# Altium schematic sheet 6_DIG.SchDoc: AX309  Http://www.heijin.org
size 449 x 250 mm; DocumentNumber: 6; SheetNumber: 7; SheetTotal: 8; PageSetup: Record=PageOptions|CenterHorizontal=True|CenterVertical=True|PrintScale=0.75|XCorrection=1.00|YCorrection=1.00|PrintKind=0|BorderSize=5000000|LeftOffset=0|BottomOffset=0|Orientation=2|PaperLength=1000|PaperWidth=1000|Scale=100|PaperSource=7|PrintQuality=-4|MediaType=1|DitherType=10|PrintScaleMode=1|PaperKind=A4|PaperIndex=9
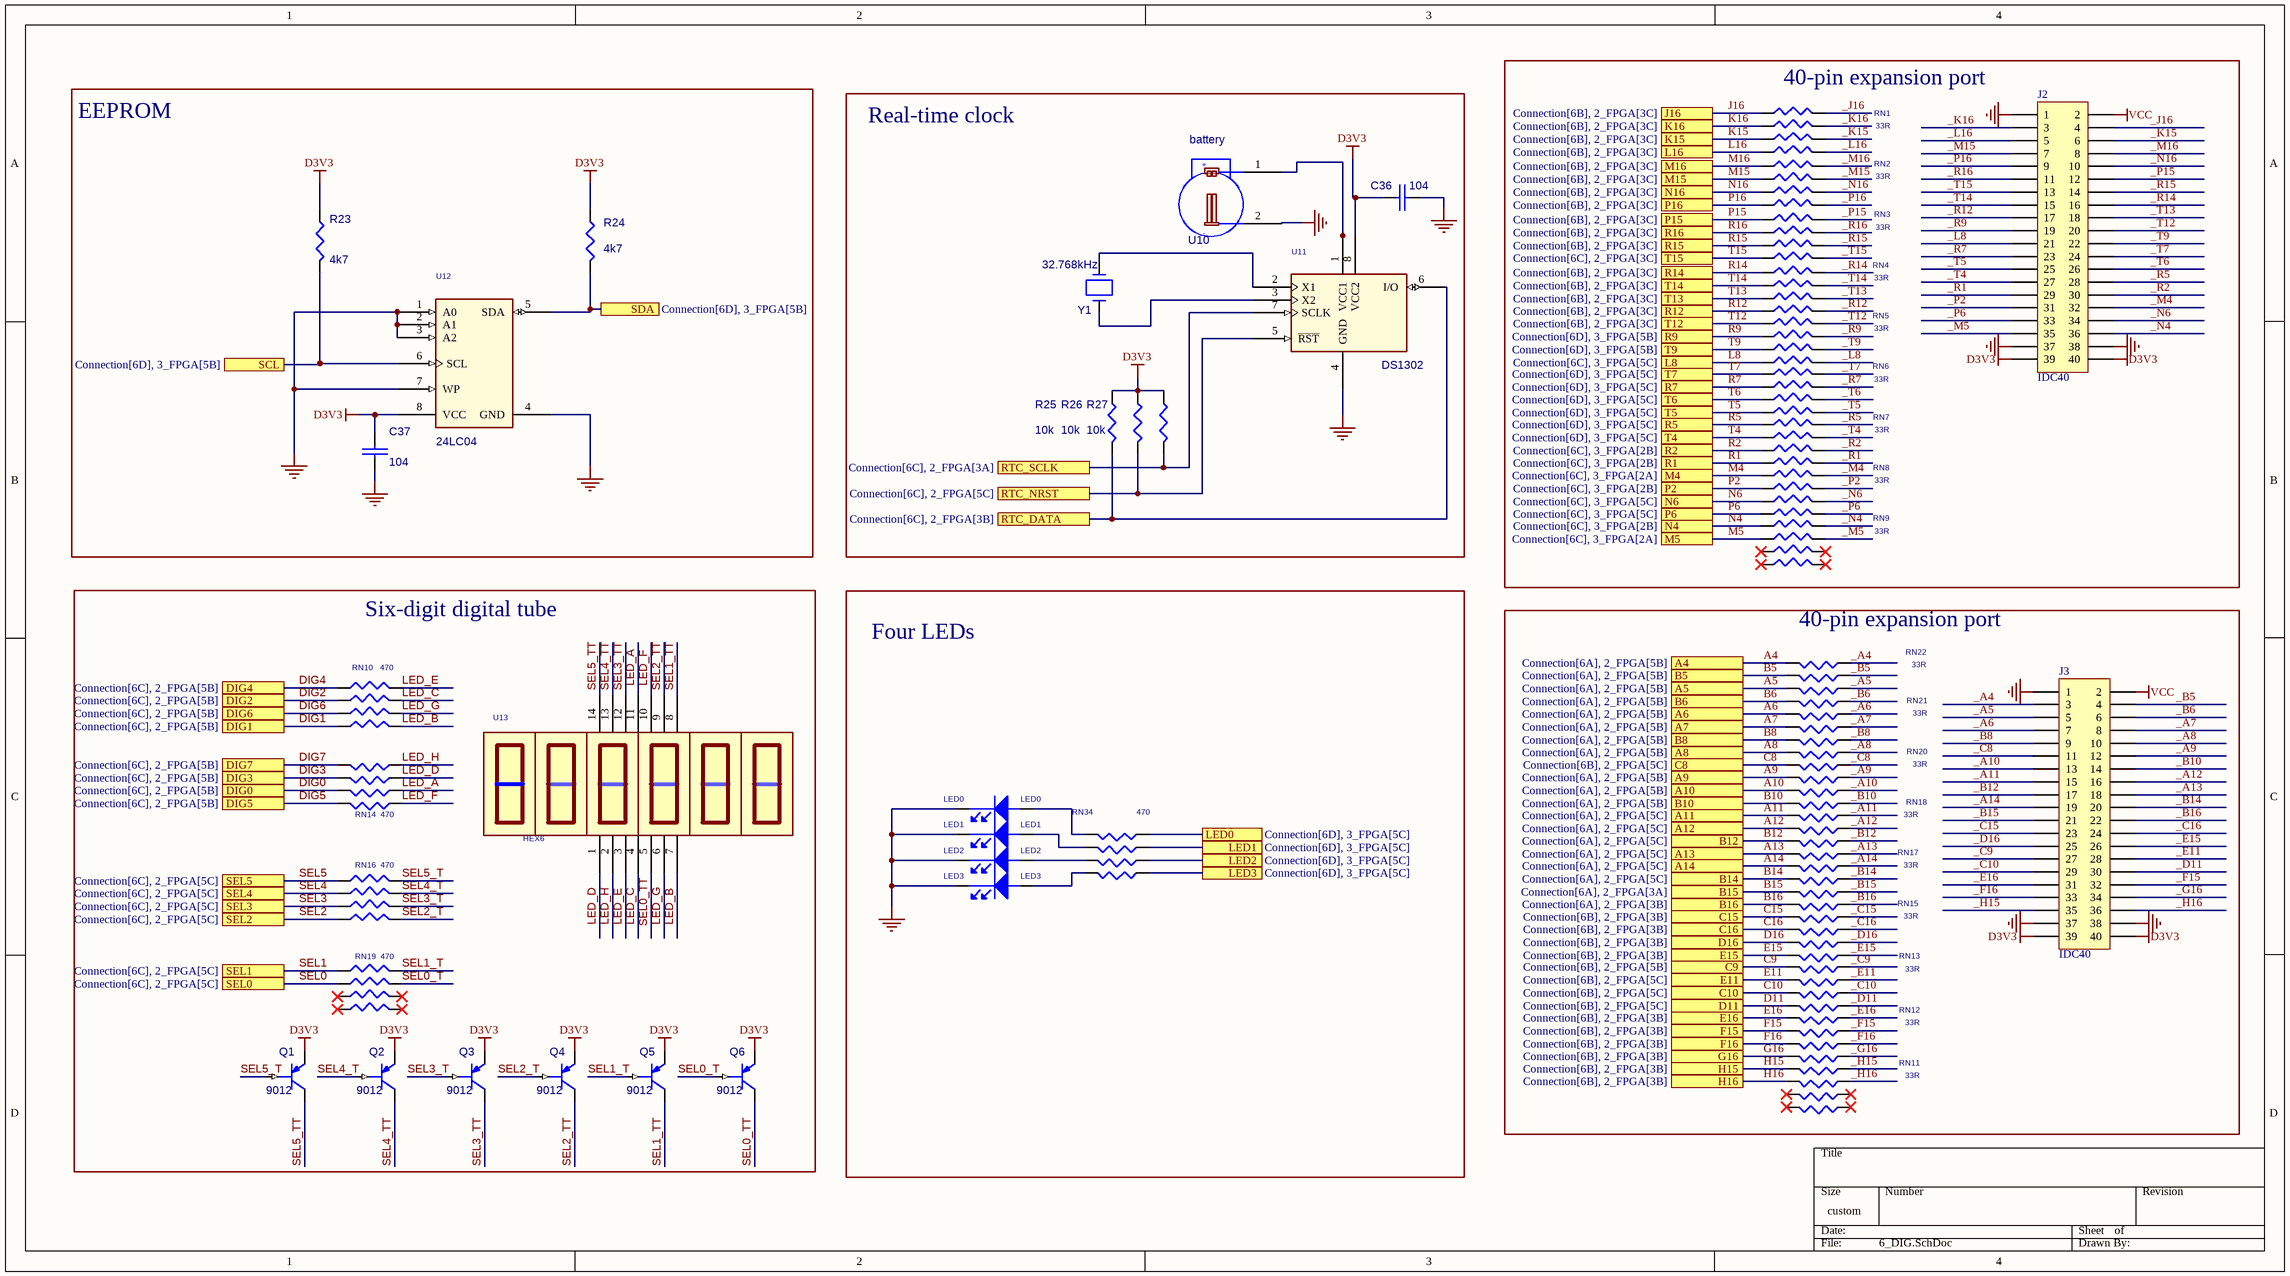
[diagram p0: 6_DIG.SchDoc]

## Parts
C36  104  [0402]
C37  104  [0402]
J2  IDC40  [IDC-40J]
J3  IDC40  [IDC-40J]
LED0  LED0  [LEDSO]
LED1  LED1  [LEDso]
LED2  LED2  [LEDSO]
LED3  LED3  [LEDSO]
Q1  9012  [SOT23]
Q2  9012  [SOT23]
Q3  9012  [SOT23]
Q4  9012  [SOT23]
Q5  9012  [SOT23]
Q6  9012  [SOT23]
R23  4k7  [0603]
R24  4k7  [0603]
R25  10k  [0603]
R26  10k  [0603]
R27  10k  [0603]
RN1  33R  [RN-8P]
RN2  33R  [RN-8P]
RN3  33R  [RN-8P]
RN4  33R  [RN-8P]
RN5  33R  [RN-8P]
RN6  33R  [RN-8P]
RN7  33R  [RN-8P]
RN8  33R  [RN-8P]
RN9  33R  [RN-8P]
RN10  470  [RN-8P]
RN11  33R  [RN-8P]
RN12  33R  [RN-8P]
RN13  33R  [RN-8P]
RN14  470  [RN-8P]
RN15  33R  [RN-8P]
RN16  470  [RN-8P]
RN17  33R  [RN-8P]
RN18  33R  [RN-8P]
RN19  470  [RN-8P]
RN20  33R  [RN-8P]
RN21  33R  [RN-8P]
RN22  33R  [RN-8P]
RN34  470  [RN-8P]
U10  battery  [BATSO]
U11  DS1302  [SO8]
U12  24LC04  [SO8]
U13  HEX6  [NIX_6]
Y1  32.768kHz  [CY_SMALL]

## Blocks framed on the sheet
40-pin expansion port: J2 RN1-RN9
EEPROM: C37 R23 R24 U12
Real-time clock: C36 R25-R27 U10 U11 Y1
Six-digit digital tube: Q1-Q6 RN10 RN14 RN16 RN19 U13
Four LEDs: LED0-LED3 RN34
40-pin expansion port: J3 RN11-RN13 RN15 RN17 RN18 RN20-RN22

## Ports
A4 (see Connection[6A], 2_FPGA[5B]), A5 (see Connection[6A], 2_FPGA[5B]), A6 (see Connection[6A], 2_FPGA[5B]), A7 (see Connection[6A], 2_FPGA[5B]), A8 (see Connection[6A], 2_FPGA[5B]), A9 (see Connection[6A], 2_FPGA[5B]), A10 (see Connection[6A], 2_FPGA[5B]), A11 (see Connection[6A], 2_FPGA[5C]), A12 (see Connection[6A], 2_FPGA[5C]), A13 (see Connection[6A], 2_FPGA[5C]), A14 (see Connection[6A], 2_FPGA[5C]), B5 (see Connection[6A], 2_FPGA[5B]), B6 (see Connection[6A], 2_FPGA[5B]), B8 (see Connection[6A], 2_FPGA[5B]), B10 (see Connection[6A], 2_FPGA[5B]), B12 (see Connection[6A], 2_FPGA[5C]), B14 (see Connection[6A], 2_FPGA[5C]), B15 (see Connection[6A], 2_FPGA[3A]), B16 (see Connection[6A], 2_FPGA[3B]), C8 (see Connection[6B], 2_FPGA[5C]), C9 (see Connection[6B], 2_FPGA[5B]), C10 (see Connection[6B], 2_FPGA[5C]), C15 (see Connection[6B], 2_FPGA[3B]), C16 (see Connection[6B], 2_FPGA[3B]), D11 (see Connection[6B], 2_FPGA[5C]), D16 (see Connection[6B], 2_FPGA[3B]), DIG0 (see Connection[6C], 2_FPGA[5B]), DIG1 (see Connection[6C], 2_FPGA[5B]), DIG2 (see Connection[6C], 2_FPGA[5B]), DIG3 (see Connection[6C], 2_FPGA[5B]), DIG4 (see Connection[6C], 2_FPGA[5B]), DIG5 (see Connection[6C], 2_FPGA[5B]), DIG6 (see Connection[6C], 2_FPGA[5B]), DIG7 (see Connection[6C], 2_FPGA[5B]), E11 (see Connection[6B], 2_FPGA[5C]), E15 (see Connection[6B], 2_FPGA[3B]), E16 (see Connection[6B], 2_FPGA[3B]), F15 (see Connection[6B], 2_FPGA[3B]), F16 (see Connection[6B], 2_FPGA[3B]), G16 (see Connection[6B], 2_FPGA[3B]), H15 (see Connection[6B], 2_FPGA[3B]), H16 (see Connection[6B], 2_FPGA[3B]), J16 (see Connection[6B], 2_FPGA[3C]), K15 (see Connection[6B], 2_FPGA[3C]), K16 (see Connection[6B], 2_FPGA[3C]), L8 (see Connection[6C], 3_FPGA[5C]), L16 (see Connection[6B], 2_FPGA[3C]), LED0 (see Connection[6D], 3_FPGA[5C]), LED1 (see Connection[6D], 3_FPGA[5C]), LED2 (see Connection[6D], 3_FPGA[5C]), LED3 (see Connection[6D], 3_FPGA[5C]), M4 (see Connection[6C], 3_FPGA[2A]), M5 (see Connection[6C], 3_FPGA[2A]), M15 (see Connection[6B], 2_FPGA[3C]), M16 (see Connection[6B], 2_FPGA[3C]), N4 (see Connection[6C], 3_FPGA[2B]), N6 (see Connection[6C], 3_FPGA[5C]), N16 (see Connection[6B], 2_FPGA[3C]), P2 (see Connection[6C], 3_FPGA[2B]), P6 (see Connection[6C], 3_FPGA[5C]), P15 (see Connection[6B], 2_FPGA[3C]), P16 (see Connection[6B], 2_FPGA[3C]), R1 (see Connection[6C], 3_FPGA[2B]), R2 (see Connection[6C], 3_FPGA[2B]), R5 (see Connection[6D], 3_FPGA[5C]), R7 (see Connection[6D], 3_FPGA[5C]), R9 (see Connection[6D], 3_FPGA[5B]), R12 (see Connection[6B], 2_FPGA[3C]), R14 (see Connection[6B], 2_FPGA[3C]), R15 (see Connection[6B], 2_FPGA[3C]), R16 (see Connection[6B], 2_FPGA[3C]), RTC_DATA (see Connection[6C], 2_FPGA[3B]), RTC_NRST (see Connection[6C], 2_FPGA[5C]), RTC_SCLK (see Connection[6C], 2_FPGA[3A]), SCL (see Connection[6D], 3_FPGA[5B]), SDA (see Connection[6D], 3_FPGA[5B]), SEL0 (see Connection[6C], 2_FPGA[5C]), SEL1 (see Connection[6C], 2_FPGA[5C]), SEL2 (see Connection[6C], 2_FPGA[5C]), SEL3 (see Connection[6C], 2_FPGA[5C]), SEL4 (see Connection[6C], 2_FPGA[5C]), SEL5 (see Connection[6C], 2_FPGA[5C]), T4 (see Connection[6D], 3_FPGA[5C]), T5 (see Connection[6D], 3_FPGA[5C]), T6 (see Connection[6D], 3_FPGA[5C]), T7 (see Connection[6D], 3_FPGA[5C]), T9 (see Connection[6D], 3_FPGA[5B]), T12 (see Connection[6B], 2_FPGA[3C]), T13 (see Connection[6B], 2_FPGA[3C]), T14 (see Connection[6B], 2_FPGA[3C]), T15 (see Connection[6C], 2_FPGA[3C])

## Nets
D3V3: C36.1 C37.1 J2.39 J2.40 J3.39 J3.40 Q1.2(EMITTER) Q2.2(EMITTER) Q3.2(EMITTER) Q4.2(EMITTER) Q5.2(EMITTER) Q6.2(EMITTER) R23.1 R24.1 R25.1 R26.1 R27.1 U11.8(VCC2) U12.8(VCC)
GND: C36.2 C37.2 J2.1 J2.37 J2.38 J3.1 J3.37 J3.38 LED0.2(CATHODE) LED1.2(CATHODE) LED2.2(CATHODE) LED3.2(CATHODE) U10.2(GND) U11.4(GND) U12.1(A0) U12.2(A1) U12.3(A2) U12.4(GND) U12.7(WP)
VCC: J2.2 J3.2
_A4: J3.3 RN22.4
_A5: J3.5 RN22.2
_A6: J3.7 RN21.4
_A7: J3.8 RN21.3
_A8: J3.10 RN21.1
_A9: J3.12 RN20.3
_A10: J3.13 RN20.2
_A11: J3.15 RN18.4
_A12: J3.16 RN18.3
_A13: J3.18 RN18.1
_A14: J3.19 RN17.4
_B5: J3.4 RN22.3
_B6: J3.6 RN22.1
_B8: J3.9 RN21.2
_B10: J3.14 RN20.1
_B12: J3.17 RN18.2
_B14: J3.20 RN17.3
_B15: J3.21 RN17.2
_B16: J3.22 RN17.1
_C8: J3.11 RN20.4
_C9: J3.27 RN13.4
_C10: J3.29 RN13.2
_C15: J3.23 RN15.4
_C16: J3.24 RN15.3
_D11: J3.30 RN13.1
_D16: J3.25 RN15.2
_E11: J3.28 RN13.3
_E15: J3.26 RN15.1
_E16: J3.31 RN12.4
_F15: J3.32 RN12.3
_F16: J3.33 RN12.2
_G16: J3.34 RN12.1
_H15: J3.35 RN11.4
_H16: J3.36 RN11.3
_J16: J2.4 RN1.8
_K15: J2.6 RN1.6
_K16: J2.3 RN1.7
_L8: J2.21 RN5.5
_L16: J2.5 RN1.5
_M4: J2.32 RN8.8
_M5: J2.35 RN9.7
_M15: J2.7 RN2.7
_M16: J2.8 RN2.8
_N4: J2.36 RN9.8
_N6: J2.34 RN8.6
_N16: J2.10 RN2.6
_P2: J2.31 RN8.7
_P6: J2.33 RN8.5
_P15: J2.12 RN3.8
_P16: J2.9 RN2.5
_R1: J2.29 RN7.5
_R2: J2.30 RN7.6
_R5: J2.28 RN7.8
_R7: J2.23 RN6.7
_R9: J2.19 RN5.7
_R12: J2.17 RN4.5
_R14: J2.16 RN4.8
_R15: J2.14 RN3.6
_R16: J2.11 RN3.7
_T4: J2.27 RN7.7
_T5: J2.25 RN6.5
_T6: J2.26 RN6.6
_T7: J2.24 RN6.8
_T9: J2.22 RN5.6
_T12: J2.20 RN5.8
_T13: J2.18 RN4.6
_T14: J2.15 RN4.7
_T15: J2.13 RN3.5
A4: RN22.5 ; port A4
A5: RN22.7 ; port A5
A6: RN21.5 ; port A6
A7: RN21.6 ; port A7
A8: RN21.8 ; port A8
A9: RN20.6 ; port A9
A10: RN20.7 ; port A10
A11: RN18.5 ; port A11
A12: RN18.6 ; port A12
A13: RN18.8 ; port A13
A14: RN17.5 ; port A14
B5: RN22.6 ; port B5
B6: RN22.8 ; port B6
B8: RN21.7 ; port B8
B10: RN20.8 ; port B10
B12: RN18.7 ; port B12
B14: RN17.6 ; port B14
B15: RN17.7 ; port B15
B16: RN17.8 ; port B16
C8: RN20.5 ; port C8
C9: RN13.5 ; port C9
C10: RN13.7 ; port C10
C15: RN15.5 ; port C15
C16: RN15.6 ; port C16
D11: RN13.8 ; port D11
D16: RN15.7 ; port D16
DIG0: RN14.7 ; port DIG0
DIG1: RN10.5 ; port DIG1
DIG2: RN10.7 ; port DIG2
DIG3: RN14.6 ; port DIG3
DIG4: RN10.8 ; port DIG4
DIG5: RN14.8 ; port DIG5
DIG6: RN10.6 ; port DIG6
DIG7: RN14.5 ; port DIG7
E11: RN13.6 ; port E11
E15: RN15.8 ; port E15
E16: RN12.5 ; port E16
F15: RN12.6 ; port F15
F16: RN12.7 ; port F16
G16: RN12.8 ; port G16
H15: RN11.5 ; port H15
H16: RN11.6 ; port H16
J16: RN1.1 ; port J16
K15: RN1.3 ; port K15
K16: RN1.2 ; port K16
L8: RN5.4 ; port L8
L16: RN1.4 ; port L16
LED0: RN34.4 ; port LED0
LED1: RN34.3 ; port LED1
LED2: RN34.2 ; port LED2
LED3: RN34.1 ; port LED3
LED_A: RN14.2 U13.11
LED_B: RN10.4 U13.7
LED_C: RN10.2 U13.4
LED_D: RN14.3 U13.1
LED_E: RN10.1 U13.3
LED_F: RN14.1 U13.10
LED_G: RN10.3 U13.6
LED_H: RN14.4 U13.2
M4: RN8.1 ; port M4
M5: RN9.2 ; port M5
M15: RN2.2 ; port M15
M16: RN2.1 ; port M16
N4: RN9.1 ; port N4
N6: RN8.3 ; port N6
N16: RN2.3 ; port N16
P2: RN8.2 ; port P2
P6: RN8.4 ; port P6
P15: RN3.1 ; port P15
P16: RN2.4 ; port P16
R1: RN7.4 ; port R1
R2: RN7.3 ; port R2
R5: RN7.1 ; port R5
R7: RN6.2 ; port R7
R9: RN5.2 ; port R9
R12: RN4.4 ; port R12
R14: RN4.1 ; port R14
R15: RN3.3 ; port R15
R16: RN3.2 ; port R16
RTC_DATA: R25.2 U11.6(I/O) ; port RTC_DATA
RTC_NRST: R26.2 U11.5(~{RST}) ; port RTC_NRST
RTC_SCLK: R27.2 U11.7(SCLK) ; port RTC_SCLK
SCL: R23.2 U12.6(SCL) ; port SCL
SDA: R24.2 U12.5(SDA) ; port SDA
SEL0: RN19.7 ; port SEL0
SEL0_T: Q6.1(BASE) RN19.2
SEL0_TT: Q6.3(COLLECTOR) U13.5
SEL1: RN19.8 ; port SEL1
SEL1_T: Q5.1(BASE) RN19.1
SEL1_TT: Q5.3(COLLECTOR) U13.8
SEL2: RN16.5 ; port SEL2
SEL2_T: Q4.1(BASE) RN16.4
SEL2_TT: Q4.3(COLLECTOR) U13.9
SEL3: RN16.6 ; port SEL3
SEL3_T: Q3.1(BASE) RN16.3
SEL3_TT: Q3.3(COLLECTOR) U13.12
SEL4: RN16.7 ; port SEL4
SEL4_T: Q2.1(BASE) RN16.2
SEL4_TT: Q2.3(COLLECTOR) U13.13
SEL5: RN16.8 ; port SEL5
SEL5_T: Q1.1(BASE) RN16.1
SEL5_TT: Q1.3(COLLECTOR) U13.14
T4: RN7.2 ; port T4
T5: RN6.4 ; port T5
T6: RN6.3 ; port T6
T7: RN6.1 ; port T7
T9: RN5.3 ; port T9
T12: RN5.1 ; port T12
T13: RN4.3 ; port T13
T14: RN4.2 ; port T14
T15: RN3.4 ; port T15
NetLED0_1: LED0.1(ANODE) RN34.5
NetLED1_1: LED1.1(ANODE) RN34.6
NetLED2_1: LED2.1(ANODE) RN34.7
NetLED3_1: LED3.1(ANODE) RN34.8
NetU10_1: U10.1(VBAT) U11.1(VCC1)
NetU11_2: U11.2(X1) Y1.1
NetU11_3: U11.3(X2) Y1.2

Not connected (* = marked no-connect by the designer): RN9 3* 4* 5* 6*; RN11 1* 2* 7* 8*; RN19 3* 4* 5* 6*

## Notes on the sheet
- Title
- Size:
- Date:
- Orcad B
- Number:
- Time:
- Revision:
- Sheet
- of
- File:
- (in symbol battery) +; -

## Library data of the parts
C36 = C_Dup3
C37 = C_Dup4
J2 J3 = MHDR2X20: Header, 20-Pin, Dual row; LatestRevisionDate: 17-Jul-2002; LatestRevisionNote: Re-released for DXP Platform.; Publisher: Altium Limited
LED0-LED3 = LED_Dup1
Q1-Q6 = PNP
R23 R24 = R_Dup6
R25-R27 = R_Dup5
RN1-RN9 RN11-RN13 RN15 RN17 RN18 RN20-RN22 = RN_Dup1
RN10 RN14 RN16 RN19 RN34 = RN
U11 = DS1302_8SO: Part Number: TMP-13; ICA_PARTNUM: $$2098133$$DS1302S; ICA_MFR_NAME: MAXIM INTEGRATED PRODUCTS INC
U12 = 24LC04B_0
Y1 = ZTA